# EAGLE design radio-86rk-SRAM-sdcard (EAGLE 9.4.1)
CNAME: Radio86RK SD card interface; CREVISION: 2.0; DESIGNER: Andy Karpov
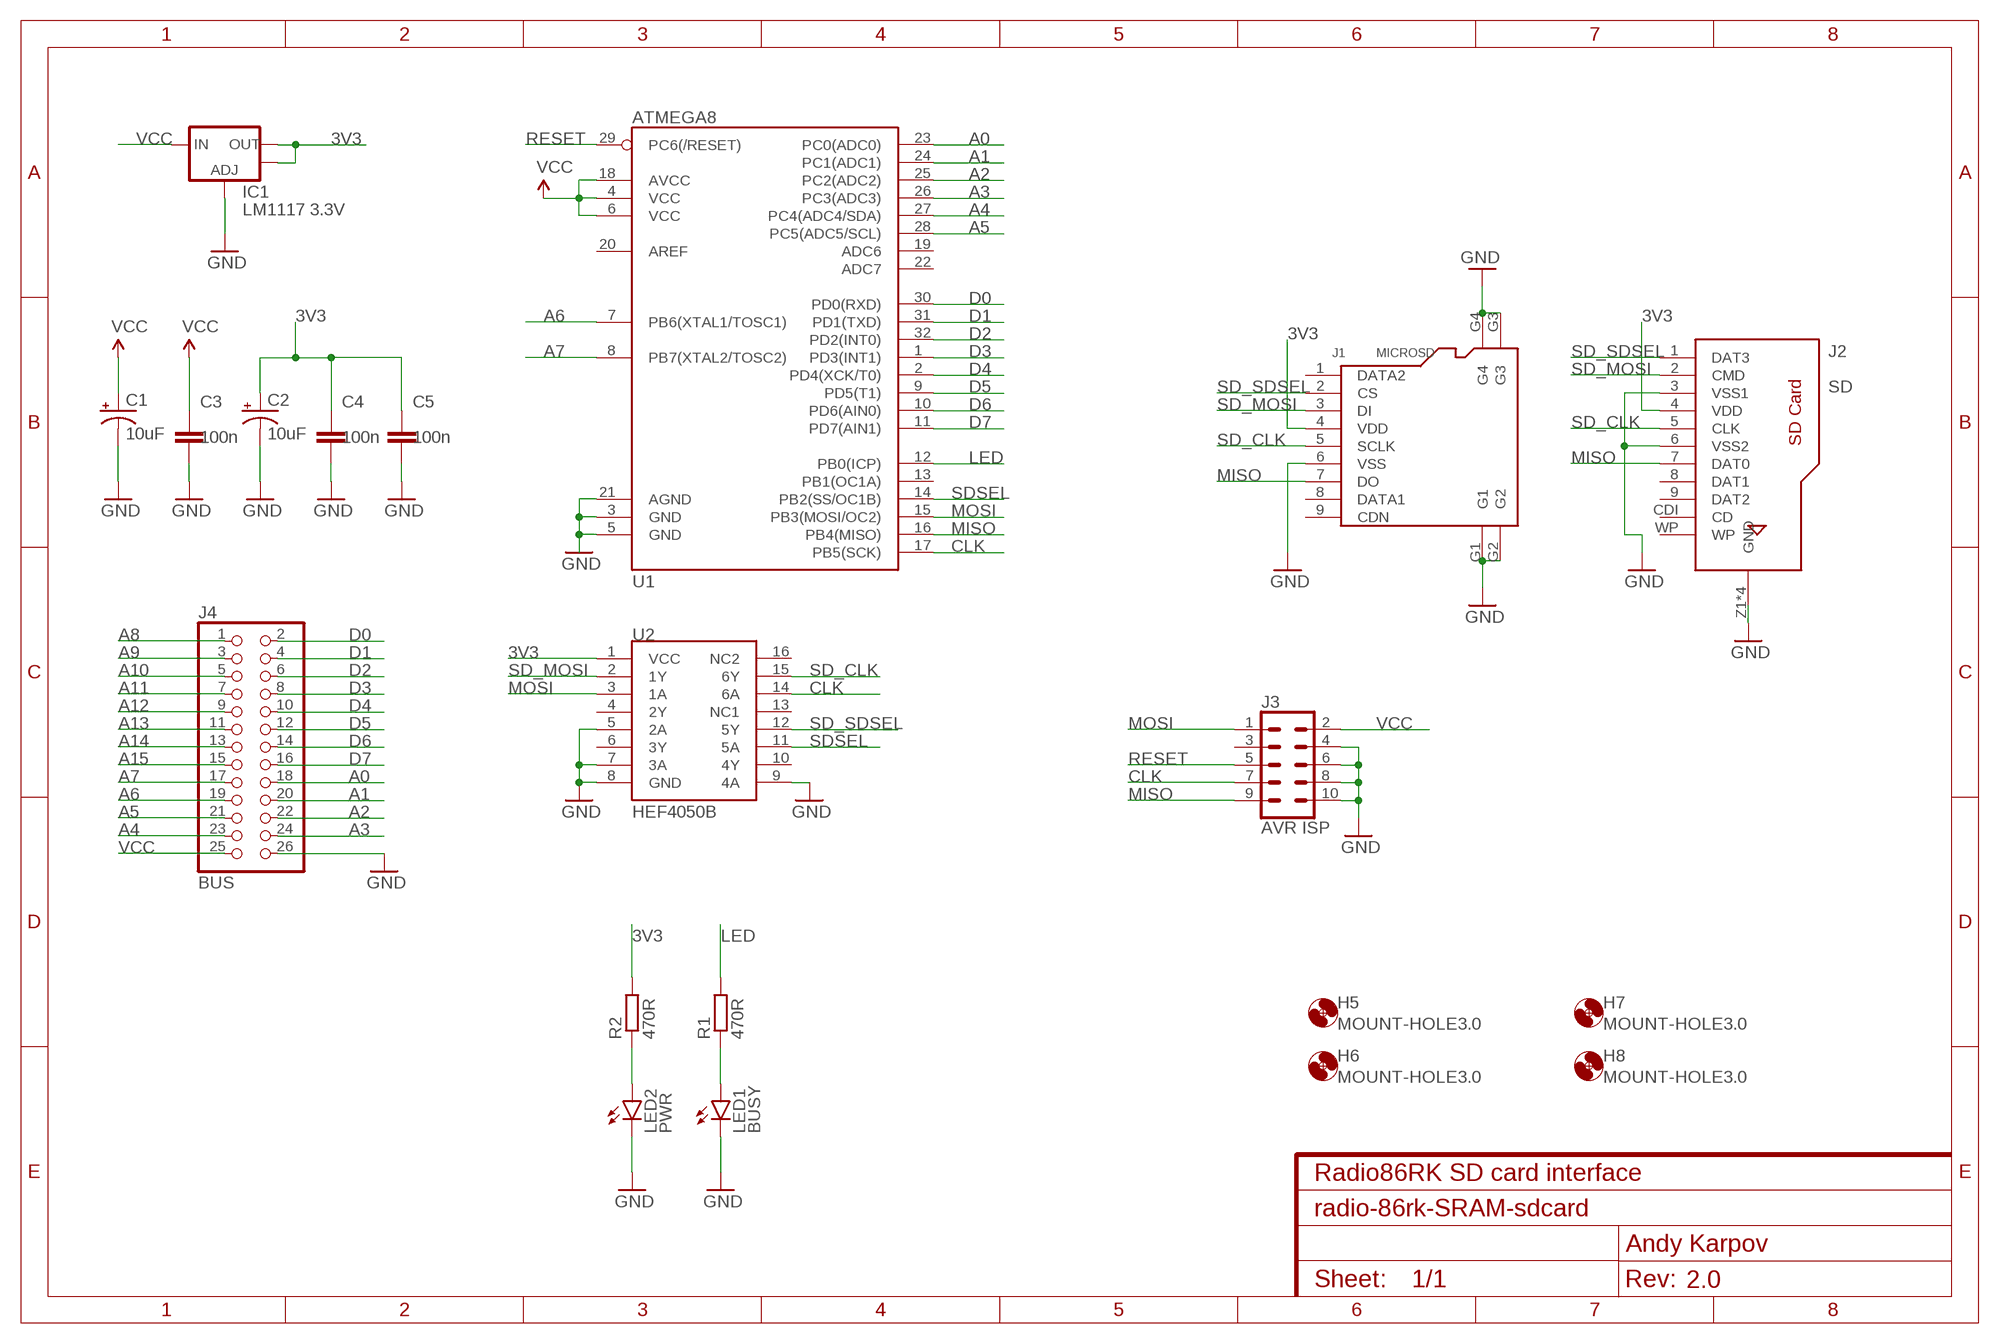
[diagram p0: schematic, sheet 1]

## Parts
C1  10uF  10UF-16V-10%(TANT)  [EIA3216]
C2  10uF  10UF-16V-10%(TANT)  [EIA3216]
C3  100n  C-EUC0805  [C0805]
C4  100n  C-EUC0805  [C0805]
C5  100n  C-EUC0805  [C0805]
H5  MOUNT-HOLE3.0  [3,0]
H6  MOUNT-HOLE3.0  [3,0]
H7  MOUNT-HOLE3.0  [3,0]
H8  MOUNT-HOLE3.0  [3,0]
IC1  LM1117 3.3V  V_REG_LM1117SOT223  [SOT223]
J1  MICROSD  MICRO-SD-CARD-HOLDER-9P  [MICRO-SD9+4P-SMD-16.1X14.5X1.85MM]
J2  SD  693063010911  [693063010911]
J3  AVR ISP  CONN_05X2SHD_LOCK  [2X5-SHROUDED_LOCK]
J4  BUS  PINHD-2X13  [2X13]
LED1  BUSY  LEDCHIP-LED0805  [CHIP-LED0805]
LED2  PWR  LEDCHIP-LED0805  [CHIP-LED0805]
R1  470R  R-EU_R0805  [R0805]
R2  470R  R-EU_R0805  [R0805]
U1  ATMEGA8  ATMEGA328_SMT  [TQFP32-08]
U2  HEF4050B  HEF4050BSO16  [SO16]

## Nets
3V3: C2.A(+) C4.1 C5.1 IC1.2(OUT) IC1.4(OUT) J1.4(VDD) J2.4(VDD) R2.2 U2.1(VCC)
A0: J4.18 U1.23(PC0(ADC0))
A1: J4.20 U1.24(PC1(ADC1))
A2: J4.22 U1.25(PC2(ADC2))
A3: J4.24 U1.26(PC3(ADC3))
A4: J4.23 U1.27(PC4(ADC4/SDA))
A5: J4.21 U1.28(PC5(ADC5/SCL))
A6: J4.19 U1.7(PB6(XTAL1/TOSC1))
A7: J4.17 U1.8(PB7(XTAL2/TOSC2))
A8: J4.1
A9: J4.3
A10: J4.5
A11: J4.7
A12: J4.9
A13: J4.11
A14: J4.13
A15: J4.15
CLK: J3.7 U1.17(PB5(SCK)) U2.14(6A)
D0: J4.2 U1.30(PD0(RXD))
D1: J4.4 U1.31(PD1(TXD))
D2: J4.6 U1.32(PD2(INT0))
D3: J4.8 U1.1(PD3(INT1))
D4: J4.10 U1.2(PD4(XCK/T0))
D5: J4.12 U1.9(PD5(T1))
D6: J4.14 U1.10(PD6(AIN0))
D7: J4.16 U1.11(PD7(AIN1))
GND: C1.C(-) C2.C(-) C3.2 C4.2 C5.2 IC1.1(ADJ) J1.6(VSS) J1.G1 J1.G2 J1.G3 J1.G4 J2.3(VSS1) J2.6(VSS2) J2.Z1(GND) J2.Z2(GND) J2.Z3(GND) J2.Z4(GND) J3.4 J3.6 J3.8 J3.10 J4.26 LED1.C LED2.C U1.3(GND) U1.5(GND) U1.21(AGND) U2.5(2A) U2.7(3A) U2.8(GND) U2.9(4A)
LED: R1.2 U1.12(PB0(ICP))
MISO: J1.7(DO) J2.7(DAT0) J3.9 U1.16(PB4(MISO))
MOSI: J3.1 U1.15(PB3(MOSI/OC2)) U2.3(1A)
N$1: LED1.A R1.1
N$2: LED2.A R2.1
RESET: J3.5 U1.29(PC6(/RESET))
SD_CLK: J1.5(SCLK) J2.5(CLK) U2.15(6Y)
SD_MOSI: J1.3(DI) J2.2(CMD) U2.2(1Y)
SD_SDSEL: J1.2(CS) J2.1(DAT3) U2.12(5Y)
SDSEL: U1.14(PB2(SS/OC1B)) U2.11(5A)
VCC: C1.A(+) C3.1 IC1.3(IN) J3.2 J4.25 U1.4(VCC) U1.6(VCC) U1.18(AVCC)
Unconnected: J1.1(DATA2) J1.8(DATA1) J1.9(CDN) J2.8(DAT1) J2.9(DAT2) J2.CDI(CD) J2.WP J3.3 U1.13(PB1(OC1A)) U1.19(ADC6) U1.20(AREF) U1.22(ADC7) U2.4(2Y) U2.6(3Y) U2.10(4Y) U2.13(NC1) U2.16(NC2)

## Library data of the parts
C1 C2 = SparkFun-Capacitors:10UF-16V-10%(TANT): CAP-00811 1206/EIA-3216 Tantalum capacitor; PROD_ID: CAP-00811
C3-C5 = rcl:C-EU: CAPACITOR, European symbol; SPICEPREFIX: C
H5-H8 = holes:MOUNT-HOLE: MOUNTING HOLE with drill center marker
IC1 = SparkFun-PowerIC:V_REG_LM1117: Voltage Regulator LM1117 Standard adjustable voltage regulator but in SMD form. Spark Fun Electronics SKU : COM-00595
J1 = OPL_Connector:MICRO-SD-CARD-HOLDER-9P: 320090008; VALUE: MICROSD-9P
J2 = Wurth_Elektronik_Electromechanic_Input-Output_Connectors_rev18b:693063010911: WR-CRD SD CARD CONNECTOR PUSH & PULL WITH CARD DETECTION 9PINS=>Code : Con_I-O_COM_CRD_SD_Normal_693063010911 <http://katalog.we-online.de/media/images/eican/Con_I-O_COM_CRD_SD_Normal_693063010911_pf2.jpg> Details see: http://katalog.we-online.de/en/em/CRD_SD_PUSH_AND_PULL_CRD_DETETCION_9_PINS/693063010911 Created 2014-07-09, Karrer Zheng 2014 (C) Würth Elektronik
J3 = SparkFun-Connectors:CONN_05X2: Multi connection point. Often used as Generic Header-pin footprint for 0.1 inch spaced/style header connections For AVR SPI programming port, see special device with nice symbol: "AVR_SPI_PROG_5x2.dev" You can populate with any combo of single row headers, but if you'd like an exact match, check these: 2x5 AVR ICSP Male Header <https://www.sparkfun.com/products/778> (PRT-00778) 2x5 Pin Shrouded Header <https://www.sparkfun.com/products/8506> (PRT-08506) On any of the 0.1 inch spaced packages, you can populate with these: Break Away Headers - Straight <https://www.sparkfun.com/products/116> (PRT-00116) Break Away Male Headers - Right Angle <https://www.sparkfun.com/products/553> (PRT-00553) Female Headers <https://www.sparkfun.com/products/115> (PRT-00115) Break Away Headers - Machine Pin <https://www.sparkfun.com/products/117> (PRT-00117) Break Away Female Headers - Swiss Machine Pin <https://www.sparkfun.com/products/743> (PRT-00743) Special note: the shrouded connector mates well with our 5x2 ribbon cables: 2x5 Pin IDC Ribbon Cable <https://www.sparkfun.com/products/8535> (PRT-08535); PROD_ID: CONN-08671; SF_ID: PRT-08506
J4 = 2x13header:PINHD-2X13: PIN HEADER
LED1 LED2 = led:LED: LED OSRAM: - CHIPLED LG R971, LG N971, LY N971, LG Q971, LY Q971, LO R971, LY R971 LH N974, LH R974 LS Q976, LO Q976, LY Q976 LO Q996 - Hyper CHIPLED LW Q18S LB Q993, LB Q99A, LB R99A - SideLED LS A670, LO A670, LY A670, LG A670, LP A670 LB A673, LV A673, LT A673, LW A673 LH A674 LY A675 LS A676, LA A676, LO A676, LY A676, LW A676 LS A679, LY A679, LG A679 - Hyper Micro SIDELED® LS Y876, LA Y876, LO Y876, LY Y876 LT Y87S - SmartLED LW L88C, LW L88S LB L89C, LB L89S, LG L890 LS L89K, LO L89K, LY L89K LS L896, LA L896, LO L896, LY L896 - TOPLED LS T670, LO T670, LY T670, LG T670, LP T670 LSG T670, LSP T670, LSY T670, LOP T670, LYG T670 LG T671, LOG T671, LSG T671 LB T673, LV T673, LT T673, LW T673 LH T674 LS T676, LA T676, LO T676, LY T676, LB T676, LH T676, LSB T676, LW T676 LB T67C, LV T67C, LT T67C, LS T67K, LO T67K, LY T67K, LW E67C LS E67B, LA E67B, LO E67B, LY E67B, LB E67C, LV E67C, LT E67C LW T67C LS T679, LY T679, LG T679 LS T770, LO T770, LY T770, LG T770, LP T770 LB T773, LV T773, LT T773, LW T773 LH T774 LS E675, LA E675, LY E675, LS T675 LS T776, LA T776, LO T776, LY T776, LB T776 LHGB T686 LT T68C, LB T68C - Hyper Mini TOPLED® LB M676 - Mini TOPLED Santana® LG M470 LS M47K, LO M47K, LY M47K Source: http://www.osram.convergy.de LUXEON: - LUMILED® LXK2-PW12-R00, LXK2-PW12-S00, LXK2-PW14-U00, LXK2-PW14-V00 LXK2-PM12-R00, LXK2-PM12-S00, LXK2-PM14-U00 LXK2-PE12-Q00, LXK2-PE12-R00, LXK2-PE12-S00, LXK2-PE14-T00, LXK2-PE14-U00 LXK2-PB12-K00, LXK2-PB12-L00, LXK2-PB12-M00, LXK2-PB14-N00, LXK2-PB14-P00, LXK2-PB14-Q00 LXK2-PR12-L00, LXK2-PR12-M00, LXK2-PR14-Q00, LXK2-PR14-R00 LXK2-PD12-Q00, LXK2-PD12-R00, LXK2-PD12-S00 LXK2-PH12-R00, LXK2-PH12-S00 LXK2-PL12-P00, LXK2-PL12-Q00, LXK2-PL12-R00 Source: www.luxeon.com KINGBRIGHT: KA-3528ASYC Source: www.kingbright.com
R1 R2 = rcl:R-EU_: RESISTOR, European symbol; SPICEPREFIX: R
U1 = SparkFun-DigitalIC:ATMEGA328_SMT: 32-Pin Atmega328 part Commonly used on Arduino compatible boards Available in QFP and QFN packages TQFP is IC-09069 QFN is non-stock; PROD_ID: IC-09069; VALUE: ATMEGA328P
U2 = hef4050b:HEF4050B: Addresable Dual Digital Potentiometer

## Board
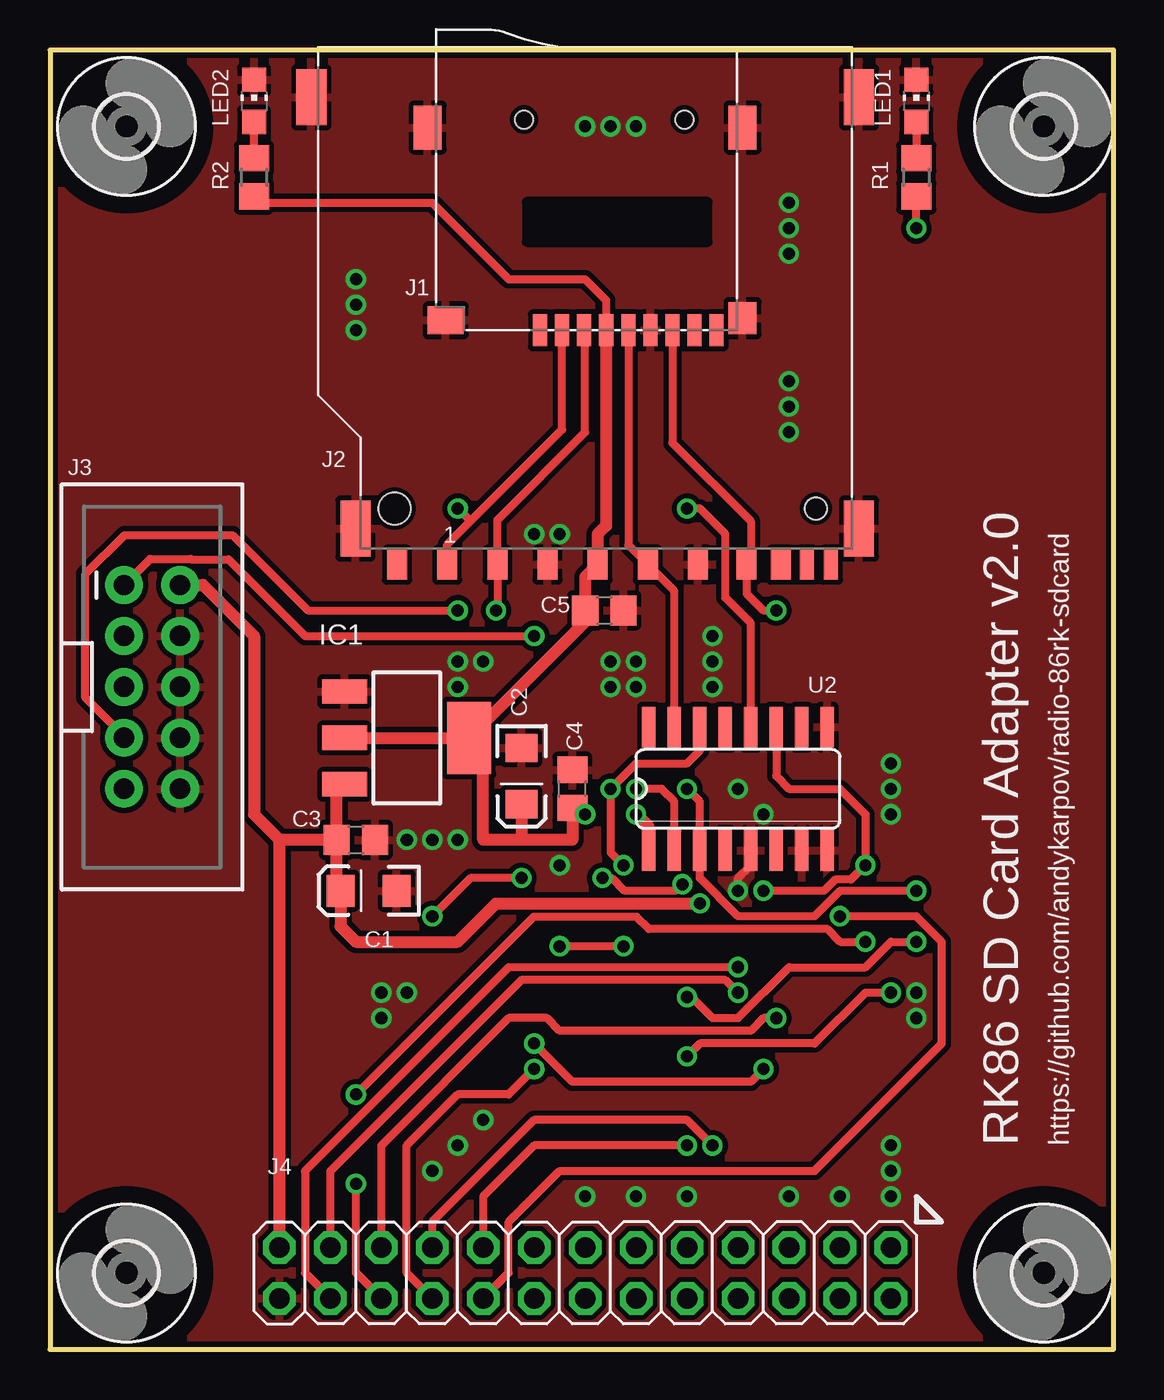
[diagram p1: board, top side]
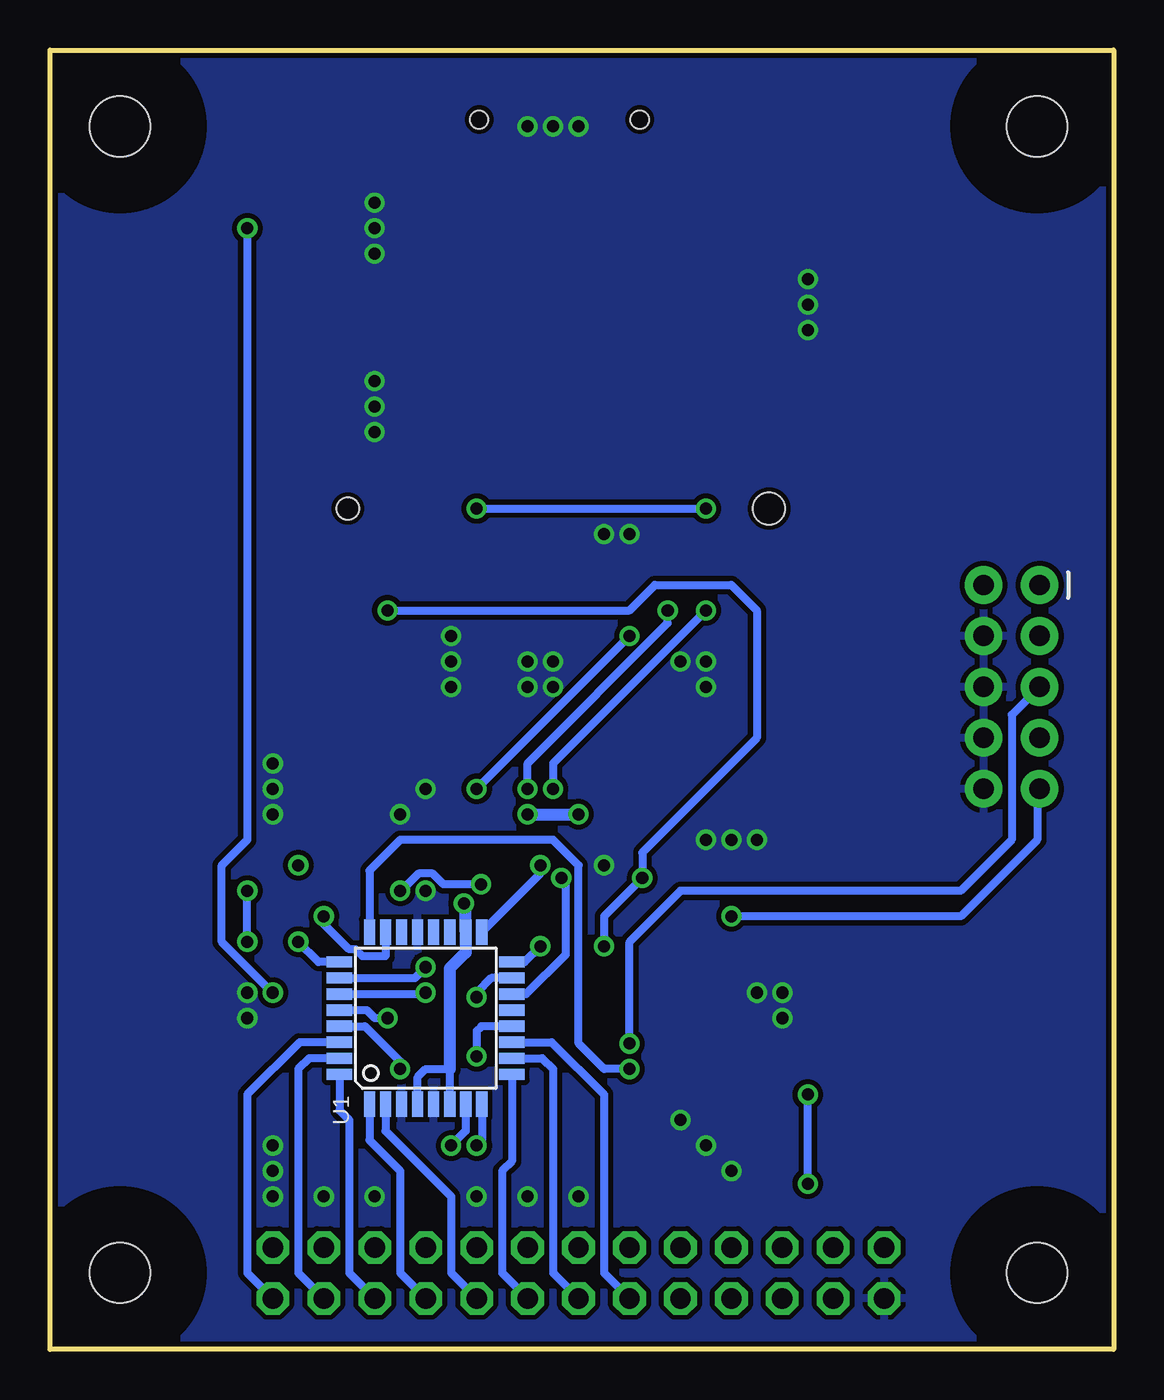
[diagram p2: board, bottom side, seen from below]

Size 53.01 x 64.76 mm. Coordinates in mm from the lower left corner, seen from the top.
Outline: 0,0 53.01,0 53.01,64.76 0,64.76 0,0
Copper layers (1*16): Top 0.035mm / dielectric 1.5mm / Bottom 0.035mm
Design rules "dfrobot": minimum track width 6mil, minimum drill 12mil, track to track 6mil, track to pad 6mil, pad to pad 6mil, via to via 6mil, smd to smd 0mil, copper to edge 10mil, drill to drill 10mil, minimum pad ring 12mil, minimum via ring 8mil, stop-mask expansion 2mil, vias tented up to drill 25mil, thermal gap 10mil

### Footprints (pad centres in the part's own frame; a part is rotated, then mirrored left to right if it is on the bottom)
EIA3216 = smd 1.4 x 1.6: A 1.4,0; C -1.4,0
C0805 = smd 1.3 x 1.5: 1 -0.95,0; 2 0.95,0
3,0 = hole 3: 0,0
SOT223 = smd 1.219 x 2.235: 1 -2.311,-3.099; 2 0,-3.099; 3 2.311,-3.099 | smd 3.6 x 2.2: 4 0,3.099
MICRO-SD9+4P-SMD-16.1X14.5X1.85MM = smd 1.6 x 0.7: 1 0,2.25; 2 0,1.15; 3 0,0.05; 4 0,-1.05; 5 0,-2.15; 6 0,-3.25; 7 0,-4.35; 8 0,-5.45; 9 0,-6.55 | smd 1.6 x 1.4: G1 0.6,-7.85 | smd 2.2 x 1.4: G2 10.1,-7.85; G3 10.1,7.85 | smd 1.4 x 1.8: G4 0.5,6.95 | hole 0.9: 10.5,-4.95; 10.5,3.05
693063010911 = smd 1 x 1.5: 1 6.875,2.8; 2 4.375,2.8; 3 1.875,2.8; 4 -0.625,2.8; 5 -3.125,2.8; 6 -5.625,2.8; 7 -8.05,2.8; 8 -9.75,2.8; 9 9.375,2.8 | smd 0.7 x 1.5: CDI -11.05,2.8; WP -12.25,2.8 | smd 1.5 x 2.8: Z1 -13.65,1; Z2 11.45,1; Z3 13.65,-20.5; Z4 -13.65,-20.5 | hole 1.1: -11.5,0 | hole 1.6: 9.5,0
2X5-SHROUDED_LOCK = drill 1.016 pad 1.88: 1 -1.397,5.08; 2 1.397,5.08; 3 -1.397,2.54; 4 1.397,2.54; 5 -1.397,0; 6 1.397,0; 7 -1.397,-2.54; 8 1.397,-2.54; 9 -1.397,-5.08; 10 1.397,-5.08
2X13 = drill 1.016 octagon: 1 -16.51,-1.27; 2 -16.51,1.27; 3 -13.97,-1.27; 4 -13.97,1.27; 5 -11.43,-1.27; 6 -11.43,1.27; 7 -8.89,-1.27; 8 -8.89,1.27; 9 -6.35,-1.27; 10 -6.35,1.27; 11 -3.81,-1.27; 12 -3.81,1.27; 13 -1.27,-1.27; 14 -1.27,1.27; 15 1.27,-1.27; 16 1.27,1.27; 17 3.81,-1.27; 18 3.81,1.27; 19 6.35,-1.27; 20 6.35,1.27; 21 8.89,-1.27; 22 8.89,1.27; 23 11.43,-1.27; 24 11.43,1.27; 25 13.97,-1.27; 26 13.97,1.27
CHIP-LED0805 = smd 1.2 x 1.2: A 0,-1.05; C 0,1.05
R0805 = smd 1.3 x 1.5: 1 -0.95,0; 2 0.95,0
TQFP32-08 = smd 1.27 x 0.559: 1 -4.293,2.8; 2 -4.293,2; 3 -4.293,1.2; 4 -4.293,0.4; 5 -4.293,-0.4; 6 -4.293,-1.2; 7 -4.293,-2; 8 -4.293,-2.8; 17 4.293,-2.8; 18 4.293,-2; 19 4.293,-1.2; 20 4.293,-0.4; 21 4.293,0.4; 22 4.293,1.2; 23 4.293,2; 24 4.293,2.8 | smd 0.559 x 1.27: 9 -2.8,-4.293; 10 -2,-4.293; 11 -1.2,-4.293; 12 -0.4,-4.293; 13 0.4,-4.293; 14 1.2,-4.293; 15 2,-4.293; 16 2.8,-4.293; 25 2.8,4.293; 26 2,4.293; 27 1.2,4.293; 28 0.4,4.293; 29 -0.4,4.293; 30 -1.2,4.293; 31 -2,4.293; 32 -2.8,4.293
SO16 = smd 0.66 x 2.032: 1 -4.445,-3.073; 2 -3.175,-3.073; 3 -1.905,-3.073; 4 -0.635,-3.073; 5 0.635,-3.073; 6 1.905,-3.073; 7 3.175,-3.073; 8 4.445,-3.073; 9 4.445,3.073; 10 3.175,3.073; 11 1.905,3.073; 12 0.635,3.073; 13 -0.635,3.073; 14 -1.905,3.073; 15 -3.175,3.073; 16 -4.445,3.073

### Placement (x,y rotation side)
C1  15.88,22.86 180 top
C2  23.5,28.57 270 top
C3  15.24,25.4 0 top
C4  26.04,27.94 90 top
C5  27.62,36.83 0 top
H5  49.53,60.96 0 top
H6  3.81,60.96 0 top
H7  49.53,3.81 0 top
H8  3.81,3.81 0 top
IC1  17.78,30.48 270 top
J1  26.67,50.8 90 top
J2  26.67,41.91 180 top
J3  5.08,33.02 0 top
J4  25.4,3.81 180 top
LED1  43.18,62.23 0 top
LED2  10.16,62.23 0 top
R1  43.18,58.42 270 top
R2  10.16,58.42 270 top
U1  34.29,16.51 90 bottom
U2  34.29,27.94 0 top

### Tracks (layer width: path | path; a pad name or v marks a point on that pad's centre or on a via)
3V3  (via drill 0.6)
  Top 0.406: C5.1 26.68,36.28 | R2.2 10.48,57.15 19.05,57.15 22.86,53.34 26.67,53.34 27.72,52.29 J1.4
  Top 0.61: IC1.2 IC1.4 | IC1.4 21.59,30.48 21.59,25.4 23.5,25.4 | 26.68,36.28 IC1.4 | U2.1 29.84,26.04 v29.21,26.67 | v26.67,26.67 26.04,26.67 | 23.5,25.4 26.04,25.4 26.04,26.67 | J1.4 27.72,41.05 27.3,40.63 J2.4 26.68,38.49 C5.1 | C2.A 23.5,25.4 | C4.1 26.04,26.67
  Bottom 0.61: v29.21,26.67 v26.67,26.67
A0  (via drill 0.6)
  Top 0.406: J4.18 22.86,3.81 22.86,6.35 25.4,8.89 38.1,8.89 44.45,15.24 44.45,20.32 43.18,21.59 v39.37,21.59
  Bottom 0.406: U1.23 36.29,19.59 37.45,19.59 37.8,19.95 38.1,19.95 39.37,21.21 v39.37,21.59
A1  (via drill 0.6)
  Top 0.406: J4.20 17.78,3.81 17.78,10.16 20.32,12.7 22.86,12.7 v24.13,13.97
  Bottom 0.406: v24.13,13.97 25.4,13.97 26.67,15.24 26.67,24.13 27.94,25.4 35.56,25.4 37.09,23.87 U1.24
A2  (via drill 0.6)
  Top 0.406: J4.22 15.24,3.81 v15.24,8.26 | v40.64,20.32 39.37,20.32 38.73,20.95 29.84,20.95 29.23,21.57 24.11,21.57 v15.24,12.7
  Bottom 0.406: U1.25 39.63,19.31 v40.64,20.32 | v15.24,8.26 v15.24,12.7
A3  (via drill 0.6)
  Top 0.406: v34.29,19.05 22.86,19.05 12.7,8.89 12.7,3.81 J4.24
  Bottom 0.406: U1.26 34.83,18.51 v34.29,19.05
A4  (via drill 0.6)
  Top 0.406: v34.29,17.78 33.66,18.41 23.5,18.41 13.97,8.89 J4.23
  Bottom 0.406: U1.27 34.36,17.71 v34.29,17.78
A5  (via drill 0.6)
  Top 0.406: v36.2,16.51 35.56,16.51 34.92,15.88 25.4,15.88 24.77,16.51 22.86,16.51 16.51,10.16 J4.21
  Bottom 0.406: U1.28 37.23,16.91 36.83,16.51 v36.2,16.51
A6  (via drill 0.6)
  Top 0.406: v33.02,10.16 31.75,11.43 24.13,11.43 19.05,6.35 J4.19
  Bottom 0.406: U1.7 32.29,10.89 v33.02,10.16
A7  (via drill 0.6)
  Top 0.406: v31.75,10.16 24.13,10.16 21.59,7.62 J4.17
  Bottom 0.406: U1.8 31.49,10.42 v31.75,10.16
CLK  (via drill 0.6)
  Top 0.406: v28.57,24.13 27.94,24.77 v27.94,27.94 29.21,29.21 31.75,29.21 32.38,29.84 U2.14 | v20.32,36.83 12.86,36.83 9.1,40.59 3.71,40.59 1.75,38.64 1.75,32.48 3.68,30.55 J3.7
  Bottom 0.406: U1.17 28.57,23.72 v28.57,24.13 | v20.32,36.83 27.94,29.21 v27.94,27.94
D0
  Bottom 0.406: U1.30 40.57,15.31 43.18,12.7 43.18,3.81 J4.2
D1
  Bottom 0.406: U1.31 40.1,14.51 40.64,13.97 40.64,3.81 J4.4
D2
  Bottom 0.406: U1.32 38.58,11.91 38.1,11.43 38.1,3.81 J4.6
D3
  Bottom 0.406: U1.1 37.09,10.42 35.56,8.89 35.56,3.81 J4.8
D4
  Bottom 0.406: U1.2 36.29,10.89 33.02,7.62 33.02,3.81 J4.10
D5
  Bottom 0.406: U1.9 30,9.37 30.48,8.89 30.48,3.81 J4.12
D6
  Bottom 0.406: U1.10 28.48,14.51 27.94,13.97 27.94,3.81 J4.14
D7
  Bottom 0.406: U1.11 28.01,15.31 25.4,12.7 25.4,3.81 J4.16
GND  (via drill 0.6)
  Top 0.406: v34.29,22.86 34.29,23.5 34.92,24.13 U2.5
  other vias: 31.75,7.62 36.83,7.62 39.37,7.62 41.91,7.62 41.91,8.89 41.91,10.16 43.18,17.78 43.18,16.51 21.59,11.43 20.32,10.16 19.05,8.89 29.21,7.62 26.67,7.62 17.78,17.78 16.51,16.51 16.51,17.78 33.02,35.56 33.02,34.29 27.94,34.29 27.94,33.02 33.02,33.02 29.21,34.29 29.21,33.02 19.05,25.4 20.32,25.4 17.78,25.4 25.4,40.64 24.13,40.64 26.67,60.96 27.94,60.96 29.21,60.96 36.83,57.15 36.83,55.88 36.83,54.61 15.24,53.34 15.24,52.07 15.24,50.8 36.83,48.26 36.83,46.99 36.83,45.72 20.32,34.29 25.4,24.13 21.59,34.29 20.32,33.02 34.29,27.94 35.56,26.67 41.91,26.67 41.91,27.94 41.91,29.21
  pour Bottom (isolate 0.254): 0,66.04 55.88,66.04 55.88,0 0,0
  pour Top (isolate 0.254): -1.27,66.04 54.61,66.04 54.61,0 -1.27,0
LED  (via drill 0.6)
  Top 0.406: v31.75,14.61 32.38,15.24 38.1,15.24 40.64,17.78 v41.91,17.78 | v43.18,55.88 R1.2
  Bottom 0.406: U1.12 31.52,16.11 31.75,15.88 v31.75,14.61 | v41.91,17.78 44.45,20.32 44.45,24.13 43.18,25.4 v43.18,55.88
MISO  (via drill 0.6)
  Top 0.406: J1.7 31.02,45.18 34.92,41.27 34.92,39.31 J2.7 34.72,37.67 35.56,36.83 v36.2,36.83 | v19.05,21.59 20.95,23.5 v23.5,23.5 | v28.57,20.1 v25.4,20.1
  Bottom 0.406: J3.9 3.81,27.81 3.81,25.4 7.62,21.59 v19.05,21.59 | v28.57,20.1 29.36,19.31 U1.16 | v25.4,20.1 25.4,21.59 v23.5,23.5 23.5,24.77 17.78,30.48 17.78,36.83 19.05,38.1 22.86,38.1 24.13,36.83 v36.2,36.83
MOSI  (via drill 0.6)
  Top 0.406: v31.75,17.56 31.97,17.56 33.02,16.51 34.29,16.51 36.83,19.05 40.64,19.05 41.91,20.32 v43.18,20.32 | v43.18,22.86 39.37,22.86 38.1,21.59 34.29,21.59 32.38,23.5 U2.3 32.38,27.3 v31.75,27.94 | J3.1 4.98,39.4 7.01,39.4 7.04,39.37 8.89,39.37 12.7,35.56 v24.13,35.56
  Bottom 0.406: U1.15 31.02,18.51 31.75,17.78 v31.75,17.56 | v43.18,20.32 v43.18,22.86 | v24.13,35.56 v31.75,27.94
N$1
  Top 0.406: LED1.A R1.1
N$2
  Top 0.406: R2.1 LED2.A
RESET  (via drill 0.6)
  Top 0.406: v35.56,13.97 34.92,13.34 26.04,13.34 v24.13,15.24
  Bottom 0.406: U1.29 37.31,16.11 35.56,14.36 v35.56,13.97 | v24.13,15.24 24.13,20.32 21.59,22.86 7.62,22.86 5.08,25.4 5.08,31.62 J3.5
SD_CLK
  Top 0.406: J1.5 28.82,40.09 J2.5 31.11,37.79 U2.15
SD_MOSI  (via drill 0.6)
  Top 0.406: U2.2 31.11,27.3 30.48,27.94 v29.21,27.94 | J1.3 26.67,50.75 26.67,45.72 22.3,41.34 J2.2 22.3,36.9 v22.23,36.83
  Bottom 0.406: v29.21,27.94 29.21,29.21 22.23,36.2 v22.23,36.83
SD_SDSEL  (via drill 0.6)
  Top 0.406: J2.1 19.8,40.12 20.95,41.27 | J1.2 25.52,45.84 20.95,41.27 | U2.12 34.92,36.2 33.66,37.47 33.66,40.64 32.38,41.91 v31.75,41.91 | v20.32,41.91 20.95,41.27
  Bottom 0.406: v31.75,41.91 v20.32,41.91
SDSEL  (via drill 0.6)
  Top 0.406: U2.11 36.2,28.57 36.83,27.94 39.37,27.94 40.64,26.67 v40.64,24.13 39.93,23.42 39.14,23.42 38.58,22.86 v35.56,22.86 | v27.53,23.5 28,23.5 28.61,22.89 31.23,22.89 v31.53,23.18
  Bottom 0.406: U1.14 29.28,17.71 27.3,19.68 27.3,23.5 v27.53,23.5 | v35.56,22.86 35.51,22.86 34.65,23.72 33.93,23.72 33.4,23.18 v31.53,23.18
VCC  (via drill 0.6)
  Top 0.61: v32.38,22.23 22.23,22.23 20.32,20.32 15.24,20.32 14.47,21.09 C1.A 14.29,23.05 C3.1 | J3.2 7.62,38.1 10.16,35.56 10.16,26.67 11.43,25.4 | J4.25 11.43,25.4 | C3.1 14.29,27.78 IC1.3 | C3.1 11.43,25.4
  Bottom 0.406: U1.6 33.09,13.97 34.29,13.97 34.69,13.57 U1.4
  Bottom 0.61: 33.09,13.97 33.09,18.98 32.29,19.78 U1.18 32.29,22.13 v32.38,22.23

### Text on the board
Pads: Ukraine / 2019
tNames: RK86 SD Card Adapter v2.0 | https://github.com/andykarpov/radio-86rk-sdcard
tStop: Ukraine / 2019